# EAGLE design BB-DS (EAGLE 6.3)
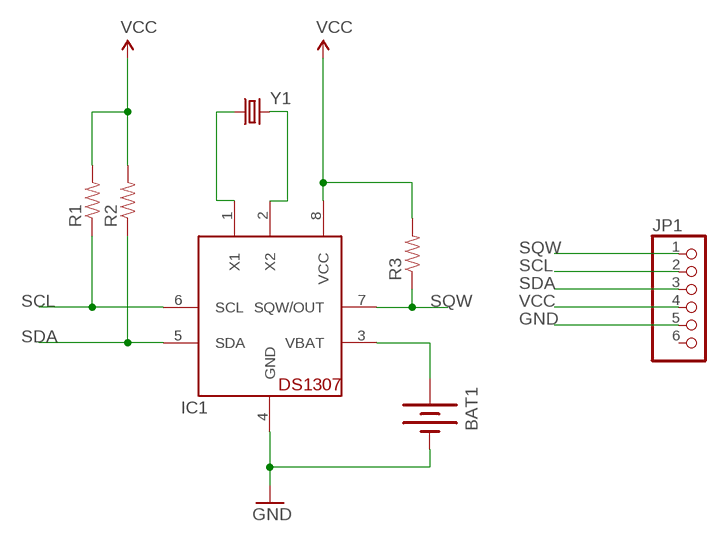
[diagram p0: schematic, sheet 1]

## Parts
BAT1  BATTERY20PTH  [BATTCOM_20MM_PTH]
IC1  DS1307  [DIL08]
JP1  PINHD-1X6B  [1X06-BIG]
R1  RESISTORPTH-1/4W  [AXIAL-0.4]
R2  RESISTORPTH-1/4W  [AXIAL-0.4]
R3  RESISTORPTH-1/4W  [AXIAL-0.4]
Y1  CRYSTALTC26H_EZ  [TC26HEZ]

## Nets
GND: BAT1.2(-) IC1.4(GND) JP1.5
N$1: IC1.1(X1) Y1.1
N$2: IC1.2(X2) Y1.2
N$3: BAT1.1(+) IC1.3(VBAT)
SCL: IC1.6(SCL) JP1.2 R1.P$1
SDA: IC1.5(SDA) JP1.3 R2.P$1
SQW: IC1.7(SQW/OUT) JP1.1 R3.P$1
VCC: IC1.8(VCC) JP1.4 R1.P$2 R2.P$2 R3.P$2
Unconnected: JP1.6

## Library data of the parts
BAT1 = SparkFun-Electromechanical:BATTERY: Battery Holders Various common sizes : AA, AAA, 20mm coin cell and 12mm coin cell.
IC1 = adafruit:DS1307: DS1307 Real time clock (RTC) with battery backup ability. Talk to it via i2c
JP1 = adafruit:PINHD-1X6: PIN HEADER
R1-R3 = SparkFun-Resistors:RESISTOR: Resistor Basic schematic elements and footprints for 0603, 1206, and PTH resistors.
Y1 = SparkFun-FreqCtrl:CRYSTAL: Various standard crystals. Proven footprints. Spark Fun Electronics SKU : COM-00534

## Board
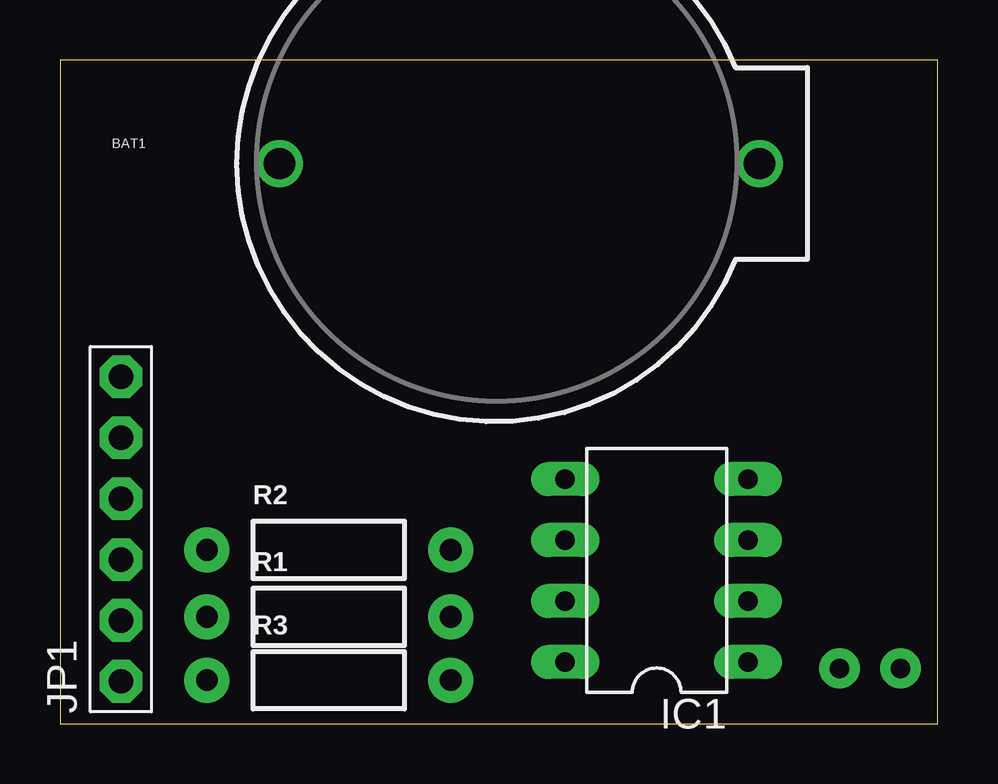
[diagram p1: board, top side]
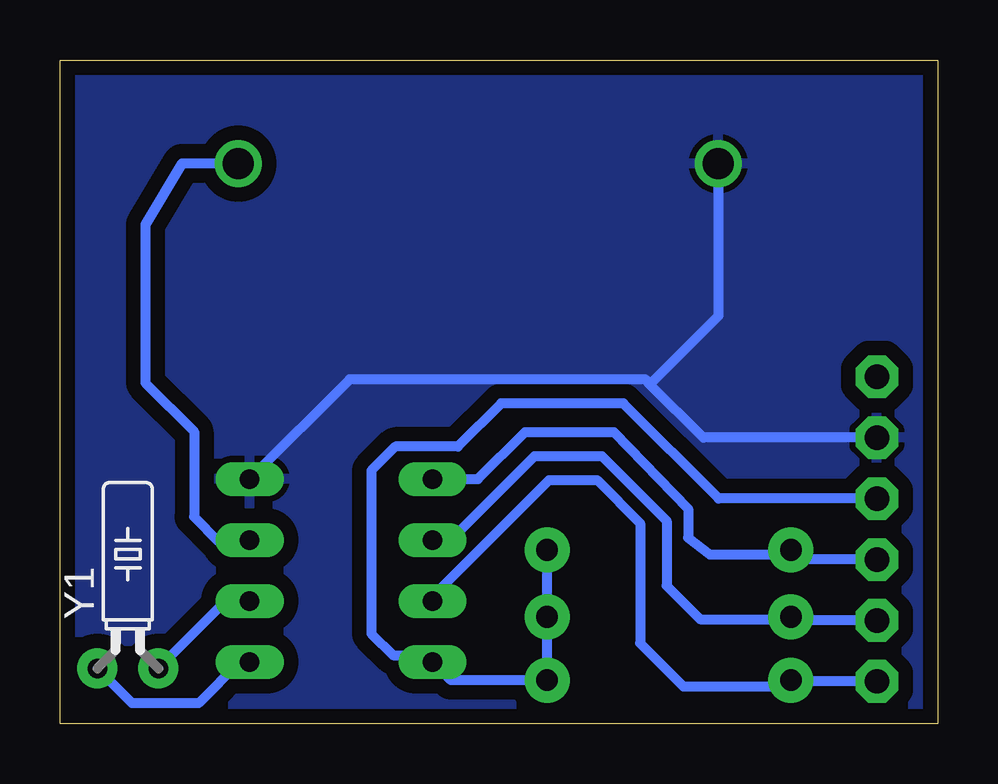
[diagram p2: board, bottom side, seen from below]

Size 36.58 x 27.69 mm. Coordinates in mm from the lower left corner, seen from the top.
Outline: 0,0 36.58,0 36.58,27.69 0,27.69 0,0
Copper layers (1*16): Top 0.035mm / dielectric 1.5mm / Bottom 0.035mm
Design rules "SparkFun": minimum track width 8mil, minimum drill 20mil, track to track 8mil, track to pad 8mil, pad to pad 8mil, via to via 8mil, smd to smd 8mil, copper to edge 10mil, drill to drill 8mil, minimum pad ring 12mil, minimum via ring 10mil, stop-mask expansion 4mil, vias tented up to drill 25mil, thermal gap 10mil

### Footprints (pad centres in the part's own frame; a part is rotated, then mirrored left to right if it is on the bottom)
BATTCOM_20MM_PTH = drill 1.3: 1 20,0; 2 0,0
DIL08 = drill 0.813 long: 1 -3.81,-3.81; 2 -1.27,-3.81; 3 1.27,-3.81; 4 3.81,-3.81; 5 3.81,3.81; 6 1.27,3.81; 7 -1.27,3.81; 8 -3.81,3.81
1X06-BIG = drill 1.016 pad 1.778 octagon: 1 -6.35,0; 2 -3.81,0; 3 -1.27,0; 4 1.27,0; 5 3.81,0; 6 6.35,0
AXIAL-0.4 = drill 0.9 pad 1.88: P$1 -5.08,0; P$2 5.08,0
TC26HEZ = drill 0.813 pad 1.676: 1 -1.27,0; 2 1.27,0

### Placement (x,y rotation side)
BAT1  9.14,23.37 0 top
IC1  24.86,6.4 90 top
JP1  2.54,8.13 90 top
R1  11.2,4.47 0 top
R2  11.2,7.26 0 top
R3  11.2,1.83 0 top
Y1  33.75,2.32 0 bottom

### Tracks (layer width: path | path; a pad name or v marks a point on that pad's centre or on a via)
GND
  Bottom 0.406: JP1.5 9.77,11.94 12,14.16 | 12,14.16 12.2,14.37 24.51,14.37 IC1.4 | BAT1.2 9.14,17.02 12,14.16
  pour Bottom (isolate 0.61): 0.76,26.92 0.25,0.25 36.32,0.25 36.07,27.18
N$1
  Bottom 0.406: IC1.1 29.08,2.59 30.8,0.87 33.57,0.87 Y1.1
N$2
  Bottom 0.406: IC1.2 29.67,5.13 Y1.2
N$3
  Bottom 0.406: BAT1.1 31.5,23.37 33.02,20.83 33.02,14.22 30.99,12.19 30.99,8.64 29.97,7.62 28.72,7.62 IC1.3
SCL
  Bottom 0.406: IC1.6 20.3,7.67 16.8,11.17 14,11.17 11.3,8.47 11.3,5.77 9.9,4.37 6.22,4.37 R1.P$1 5.97,4.32 JP1.2
SDA
  Bottom 0.406: JP1.3 5.72,6.86 R2.P$1 6.31,7.07 9.5,7.07 10.4,7.77 10.4,8.97 13.5,12.17 17.2,12.17 19.16,10.21 IC1.5
SQW
  Bottom 0.406: JP1.1 6.07,1.78 R3.P$1 6.38,1.57 10.6,1.57 12.4,3.37 12.4,8.37 14.2,10.17 16.2,10.17 21.05,5.32 IC1.7
VCC
  Bottom 0.406: JP1.4 9.13,9.4 13.1,13.37 18.2,13.37 20,11.57 22.6,11.57 23.6,10.57 23.6,3.77 22.7,2.87 21.33,2.87 IC1.8 20.29,1.83 R3.P$2 R1.P$2 R2.P$2